# Altium schematic sheet Power Distribution - Power Path MOSFET.SchDoc: Title
size B; Organization: Midnight Sun Solar Rayce Car Team; Address1: University of Waterloo; Address2: 200 University Ave W; Address3: Waterloo, ON, Canada; Address4: N2L 3E9; Website: www.uwmidsun.com; ProjectName: ProjectName
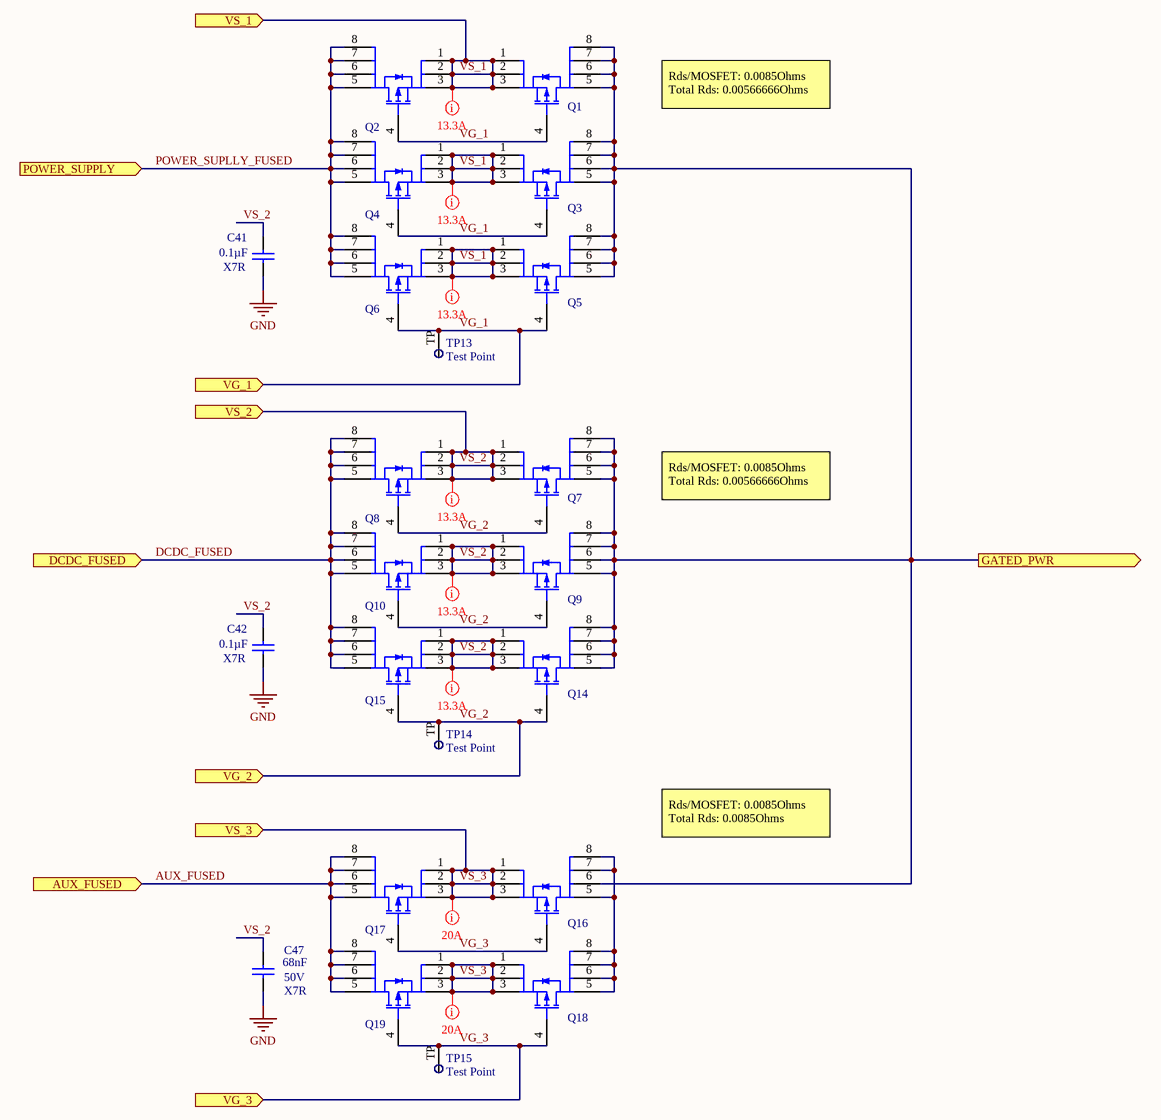
[diagram p0: Power Distribution - Power Path MOSFET.SchDoc]

## Parts
C41  Capacitance: 0.1µF  Temperature Coefficient: X7R  [CAP, 0603]  (hidden comment: CAP CER 0.1UF 50V 10% X7R 0603)
C42  Capacitance: 0.1µF  Temperature Coefficient: X7R  [CAP, 0603]  (hidden comment: CAP CER 0.1UF 50V 10% X7R 0603)
C47  68nF  Voltage Rating: 50V  Dielectric: X7R  [CAP, 0603]
Q1  MOSFET P-CH PWR56 40V 4.9 MOHM  [PMOS PWR56 40V 4.9 MOHM]  (value not drawn)
Q2  MOSFET P-CH PWR56 40V 4.9 MOHM  [PMOS PWR56 40V 4.9 MOHM]  (value not drawn)
Q3  MOSFET P-CH PWR56 40V 4.9 MOHM  [PMOS PWR56 40V 4.9 MOHM]  (value not drawn)
Q4  MOSFET P-CH PWR56 40V 4.9 MOHM  [PMOS PWR56 40V 4.9 MOHM]  (value not drawn)
Q5  MOSFET P-CH PWR56 40V 4.9 MOHM  [PMOS PWR56 40V 4.9 MOHM]  (value not drawn)
Q6  MOSFET P-CH PWR56 40V 4.9 MOHM  [PMOS PWR56 40V 4.9 MOHM]  (value not drawn)
Q7  MOSFET P-CH PWR56 40V 4.9 MOHM  [PMOS PWR56 40V 4.9 MOHM]  (value not drawn)
Q8  MOSFET P-CH PWR56 40V 4.9 MOHM  [PMOS PWR56 40V 4.9 MOHM]  (value not drawn)
Q9  MOSFET P-CH PWR56 40V 4.9 MOHM  [PMOS PWR56 40V 4.9 MOHM]  (value not drawn)
Q10  MOSFET P-CH PWR56 40V 4.9 MOHM  [PMOS PWR56 40V 4.9 MOHM]  (value not drawn)
Q14  MOSFET P-CH PWR56 40V 4.9 MOHM  [PMOS PWR56 40V 4.9 MOHM]  (value not drawn)
Q15  MOSFET P-CH PWR56 40V 4.9 MOHM  [PMOS PWR56 40V 4.9 MOHM]  (value not drawn)
Q16  MOSFET P-CH PWR56 40V 4.9 MOHM  [PMOS PWR56 40V 4.9 MOHM]  (value not drawn)
Q17  MOSFET P-CH PWR56 40V 4.9 MOHM  [PMOS PWR56 40V 4.9 MOHM]  (value not drawn)
Q18  MOSFET P-CH PWR56 40V 4.9 MOHM  [PMOS PWR56 40V 4.9 MOHM]  (value not drawn)
Q19  MOSFET P-CH PWR56 40V 4.9 MOHM  [PMOS PWR56 40V 4.9 MOHM]  (value not drawn)
TP13  Test Point  [Test Point]  (no BOM)
TP14  Test Point  [Test Point]  (no BOM)
TP15  Test Point  [Test Point]  (no BOM)

## Ports
AUX_FUSED (in), DCDC_FUSED (in), GATED_PWR (out), POWER_SUPPLY (in), VG_1 (in), VG_2 (in), VG_3 (in), VS_1 (in), VS_2 (in), VS_3 (in)

## Nets
GND: C41.2 C42.2 C47.2
AUX_FUSED: Q17.5(D) Q17.6(D) Q17.7(D) Q17.8(D) Q19.5(D) Q19.6(D) Q19.7(D) Q19.8(D) ; port AUX_FUSED
DCDC_FUSED: Q8.5(D) Q8.6(D) Q8.7(D) Q8.8(D) Q10.5(D) Q10.6(D) Q10.7(D) Q10.8(D) Q15.5(D) Q15.6(D) Q15.7(D) Q15.8(D) ; port DCDC_FUSED
GATED_PWR: Q1.5(D) Q1.6(D) Q1.7(D) Q1.8(D) Q3.5(D) Q3.6(D) Q3.7(D) Q3.8(D) Q5.5(D) Q5.6(D) Q5.7(D) Q5.8(D) Q7.5(D) Q7.6(D) Q7.7(D) Q7.8(D) Q9.5(D) Q9.6(D) Q9.7(D) Q9.8(D) Q14.5(D) Q14.6(D) Q14.7(D) Q14.8(D) Q16.6(D) ; port GATED_PWR
POWER_SUPLLY_FUSED: Q2.5(D) Q2.6(D) Q2.7(D) Q2.8(D) Q4.5(D) Q4.6(D) Q4.7(D) Q4.8(D) Q6.5(D) Q6.6(D) Q6.7(D) Q6.8(D) ; port POWER_SUPPLY
VG_1: Q1.4(G) Q2.4(G) Q3.4(G) Q4.4(G) Q5.4(G) Q6.4(G) TP13.TP ; port VG_1
VG_2: Q7.4(G) Q8.4(G) Q9.4(G) Q10.4(G) Q14.4(G) Q15.4(G) TP14.TP ; port VG_2
VG_3: Q16.4(G) Q17.4(G) Q18.4(G) Q19.4(G) TP15.TP ; port VG_3
VS_1: Q1.1(S) Q1.2(S) Q1.3(S) Q2.1(S) Q2.2(S) Q2.3(S) Q3.1(S) Q3.2(S) Q3.3(S) Q4.1(S) Q4.2(S) Q4.3(S) Q5.1(S) Q5.2(S) Q5.3(S) Q6.1(S) Q6.2(S) Q6.3(S) ; port VS_1
VS_2: C41.1 C42.1 C47.1 Q7.1(S) Q7.2(S) Q7.3(S) Q8.1(S) Q8.2(S) Q8.3(S) Q9.1(S) Q9.2(S) Q9.3(S) Q10.1(S) Q10.2(S) Q10.3(S) Q14.1(S) Q14.2(S) Q14.3(S) Q15.1(S) Q15.2(S) Q15.3(S) ; port VS_2
VS_3: Q16.1(S) Q16.2(S) Q16.3(S) Q17.1(S) Q17.2(S) Q17.3(S) Q18.1(S) Q18.2(S) Q18.3(S) Q19.1(S) Q19.2(S) Q19.3(S) ; port VS_3
NetQ16_5: Q16.5(D) Q16.7(D) Q16.8(D) Q18.5(D) Q18.6(D) Q18.7(D) Q18.8(D)

## Layout directives
net class HighCurrent; rule Power Plane Connect Style [Style - Direct Connect]; rule Polygon Connect Style [Style - Direct Connect]: VS_1, VS_2, VS_3

## Notes on the sheet
- Rds/MOSFET: 0.0085Ohms
  Total Rds: 0.00566666Ohms
- Rds/MOSFET: 0.0085Ohms
  Total Rds: 0.0085Ohms
- PROJECT
- DOCUMENT
- DRAWN BY
- LAST MODIFIED
- PART NUMBER
- REVISION
- SHEET
- VARIANT
- OF
- Engineering 5 - 1002
  University of Waterloo
  (519) 888-4567 x32978
  hardware@uwmidsun.com

## Library data of the parts
C41 C42 = CAP CER 0.1UF 50V 10% X7R 0603: 0.10µF ±10% 50V Ceramic Capacitor X7R 0603 (1608 Metric); Manufacturer 1: AVX Corporation; Manufacturer Part Number 1: 06035C104KAT2A; Supplier 1: Digi-Key; Supplier Part Number 1: 478-5052-1-ND; Packaging: Cut Tape (CT); Part Status: Active; Operating Temperature: -55°C ~ 125°C; Ratings: -; Mounting Type: Surface Mount, MLCC; Package / Case: 0603 (1608 Metric); Size / Dimension: 0.063" L x 0.032" W (1.60mm x 0.81mm); Height - Seated (Max): -; Thickness (Max): 0.035" (0.90mm); Lead Spacing: -; Lead Style: -; ComponentLink1URL: http://datasheets.avx.com/X7RDielectric.pdf; ComponentLink1Description: http://datasheets.avx.com/X7RDielectric.pdf; Tolerance: ±10%; Voltage: 50V
C47 = CAP CER 0.068UF 10% 50V X7R 0603: 0.068µF 50V Ceramic Capacitor X7R 0603 (1608 Metric) 0.063" L x 0.032" W (1.60mm x 0.80mm); Manufacturer: Murata; Manufacturer Part Number: GCM188R71H683KA57D; Tolerance: 10%; Supplier 1: Digi-Key; Stock 1: 40000; Pricing 1: 1=0.16, 10=0.116, 100=0.0547, 500=0.03832, 1000=0.03172 (USD); Mount: Surface Mount; Case/Package: 0603; Case Code (Metric): 1608; Case Code (Imperial): 0603; Min Operating Temperature: -55°C; Max Operating Temperature: 125°C; Packaging: Tape and Reel; Capacitance: 68nF; Package Quantity: 4000; Voltage Rating (DC): 50V; Termination: SMD/SMT; Length: 1.6mm; Height: 0.8mm; Width: 0.031inch; Thickness: 0.035inch; Depth: 0.8mm; Radiation Hardening: No; ComponentLink1URL: https://datasheet.ciiva.com/29542/s0717e-29542427.pdf; ComponentLink1Description: https://datasheet.ciiva.com/29542/s0717e-29542427.pdf; ComponentLink2URL: https://datasheet.ciiva.com/29542/s0717e-29542428.pdf; ComponentLink2Description: https://datasheet.ciiva.com/29542/s0717e-29542428.pdf; ComponentLink3URL: https://datasheet.ciiva.com/29542/s0717e-29542429.pdf; ComponentLink3Description: https://datasheet.ciiva.com/29542/s0717e-29542429.pdf; Supplier Part Number 1: 490-8027-1-ND
Q1-Q10 Q14-Q19 = MOSFET P-CH PWR56 40V 4.9 MOHM: P-Channel 16V 2.5A (Ta) 650mW (Ta) Surface Mount X2-DFN2015-3; Current - Continuous Drain (Id) @ 25°C: 80A (Tc); Drive Voltage (Max Rds On,  Min Rds On): 4.5V, 10V; Vgs(th) (Max) @ Id: 3V @ 250µA; Gate Charge (Qg) (Max) @ Vgs: 107nC @ 10V; Input Capacitance (Ciss) (Max) @ Vds: 4840pF @ 20V; Power Dissipation (Max): 214W (Tj); Rds On (Max) @ Id, Vgs: 4.9mOhm @ 80A, 10V; Packaging: Cut Tape (CT); Part Status: Active; FET Type: P-Channel; Technology: MOSFET (Metal Oxide); Drain to Source Voltage (Vdss): 40V; Vgs (Max): ±16V; FET Feature: -; Operating Temperature: -55°C ~ 175°C (TJ); Mounting Type: Surface Mount; Supplier Device Package: FDWS9508L-F085OSCT-ND; Package / Case: 8-PowerTDFN; ComponentLink1URL: https://www.onsemi.com/pub/Collateral/FDWS9508L-F085-D.PDF; ComponentLink1Description: https://www.onsemi.com/pub/Collateral/FDWS9508L-F085-D.PDF; Supplier 1: Digi-Key; Supplier Part Number 1: FDWS9508L-F085OSCT-ND